# Altium schematic sheet Antenna.SchDoc
size A4; SheetNumber: 3; SheetTotal: 3
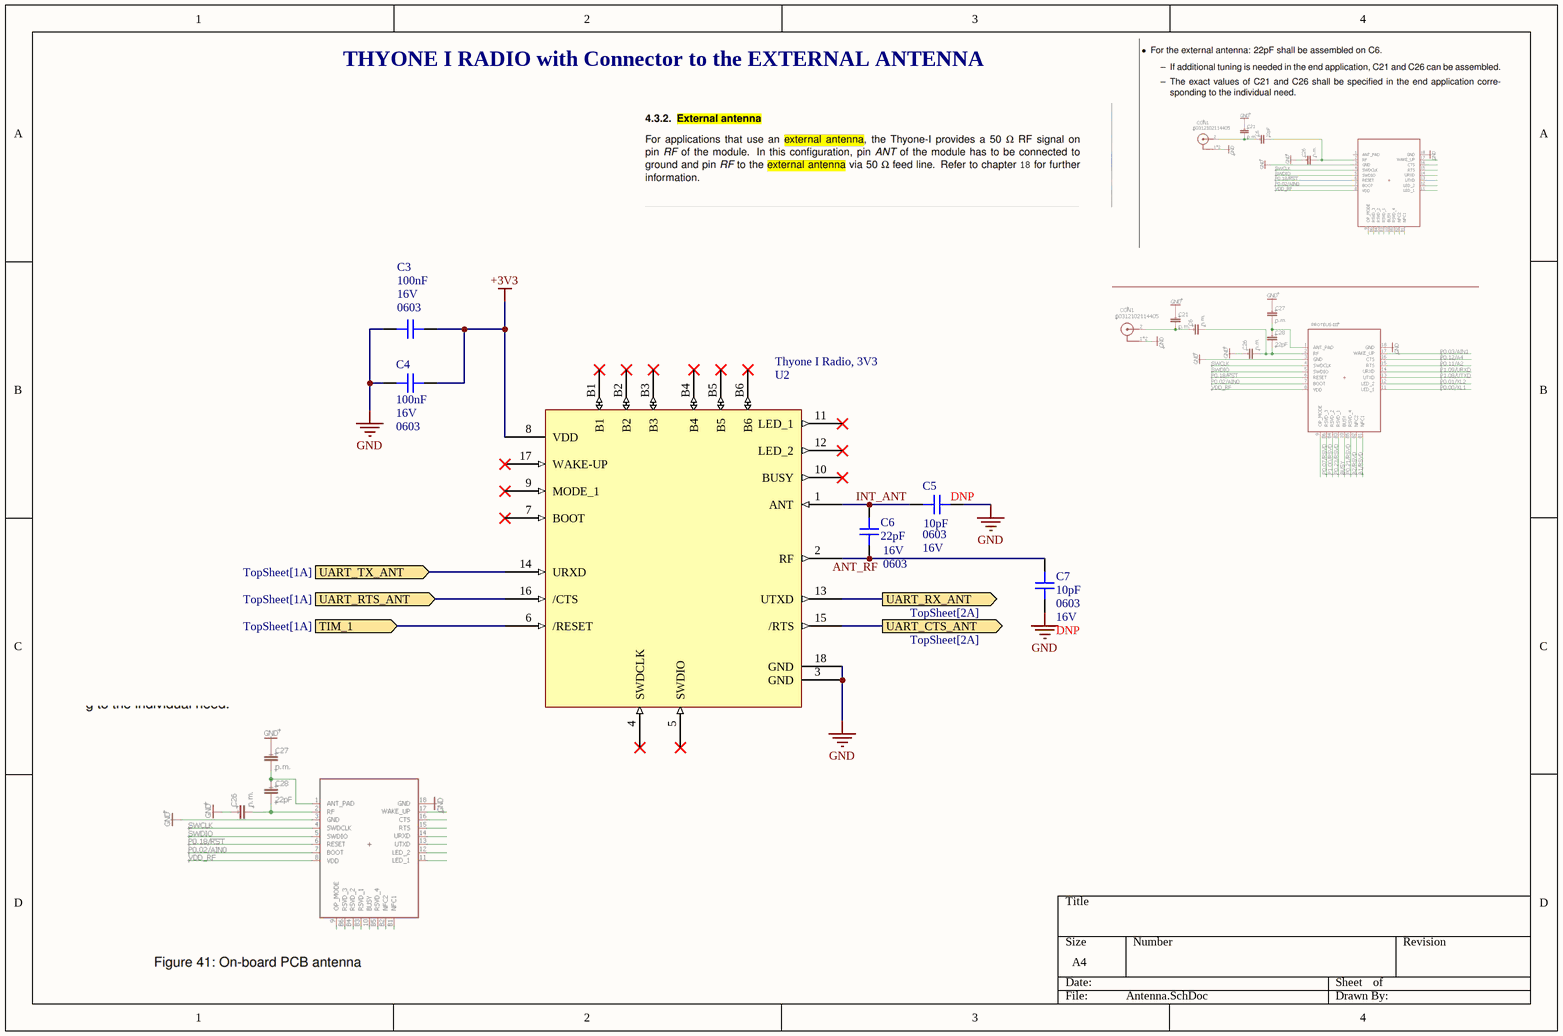
[diagram p0: Antenna.SchDoc]

## Parts
C3  value 100nF  Voltage - Rated: 16V  Package / Case: 0603  [0603_C]  (hidden comment: KGM15AR71C104KM)
C4  value 100nF  Voltage - Rated: 16V  Package / Case: 0603  [0603_C]  (hidden comment: KGM15AR71C104KM)
C5  DNP  value 10pF  Package / Case: 0603  Voltage - Rated: 16V  [0603_C]
C6  value 22pF  Voltage - Rated: 16V  Package / Case: 0603  [0603_C]  (hidden comment: KGM15ACG1C220KT)
C7  DNP  value 10pF  Package / Case: 0603  Voltage - Rated: 16V  [0603_C]
U2  Thyone I Radio, 3V3  [WE-FP-4+]

## Ports
TIM_1 (in, see TopSheet[1A]), UART_CTS_ANT (out, see TopSheet[2A]), UART_RTS_ANT (in, see TopSheet[1A]), UART_RX_ANT (out, see TopSheet[2A]), UART_TX_ANT (in, see TopSheet[1A])

## Nets
+3V3: C3.2 C4.1 U2.8(VDD)
GND: C3.1 C4.2 C5.1 C7.2 U2.3(GND) U2.18(GND)
ANT_RF: C6.1 C7.1 U2.2(RF)
INT_ANT: C5.2 C6.2 U2.1(ANT)
TIM_1: U2.6(/RESET) ; port TIM_1
UART_CTS_ANT: U2.15(/RTS) ; port UART_CTS_ANT
UART_RTS_ANT: U2.16(/CTS) ; port UART_RTS_ANT
UART_RX_ANT: U2.13(UTXD) ; port UART_RX_ANT
UART_TX_ANT: U2.14(URXD) ; port UART_TX_ANT

Not connected (* = marked no-connect by the designer): U2 4(SWDCLK)* 5(SWDIO)* 7(BOOT)* 9(MODE_1)* 10(BUSY)* 11(LED_1)* 12(LED_2)* 17(WAKE-UP)* B1* B2* B3* B4* B5* B6*

## Notes on the sheet
- THYONE I RADIO with Connector to the EXTERNAL ANTENNA

## Library data of the parts
C3 C4 = CMP-001-00851-1: CAP CER 0.1UF 16V X7R 0603; Manufacture: KYOCERA AVX; Tolerance: 10%; Product Status: Active; Mounting Type: Surface Mount, MLCC; Case/Package: Tape & Reel (TR),Cut Tape (CT),Digi-Reel®; Temperature Coefficient: X7R; Applications: General Purpose; Thickness (Max): 0.035" (0.90mm); Manufacture Part Number: KGM15AR71C104KM; Size / Dimension: 0.063" L x 0.032" W (1.60mm x 0.81mm); Operating Temperature: -55°C ~ 125°C; Series: KGM - X7R
C5 C7 = CMP-001-00327-1: CAP CER 10PF 16V C0G/NP0 0603; Manufacture Part Number: KGM15ACG1C100JT; Manufacture: KYOCERA AVX; Tolerance: 5%; Product Status: Active; Temperature Coefficient: C0G, NP0; Thickness (Max): 0.035" (0.90mm); Applications: General Purpose; Operating Temperature: -55°C ~ 125°C; Case/Package: Tape & Reel (TR),Cut Tape (CT),Digi-Reel®; Size / Dimension: 0.063" L x 0.032" W (1.60mm x 0.81mm); Series: KGM - C0G; Mounting Type: Surface Mount, MLCC
C6 = CMP-001-00865-1: CAP CER 22PF 16V C0G/NP0 0603; Manufacture: KYOCERA AVX; Temperature Coefficient: C0G, NP0; Product Status: Active; Tolerance: 10%; Mounting Type: Surface Mount, MLCC; Case/Package: Tape & Reel (TR),Cut Tape (CT),Digi-Reel®; Manufacture Part Number: KGM15ACG1C220KT; Operating Temperature: -55°C ~ 125°C; Size / Dimension: 0.063" L x 0.032" W (1.60mm x 0.81mm); Thickness (Max): 0.035" (0.90mm); Series: KGM - C0G; Applications: General Purpose
U2 = 2611011021000: Supplier 1: Mouser; Supplier Part Number 1: 710-2611011021000